# Altium schematic sheet Sheet2.SchDoc
size A4
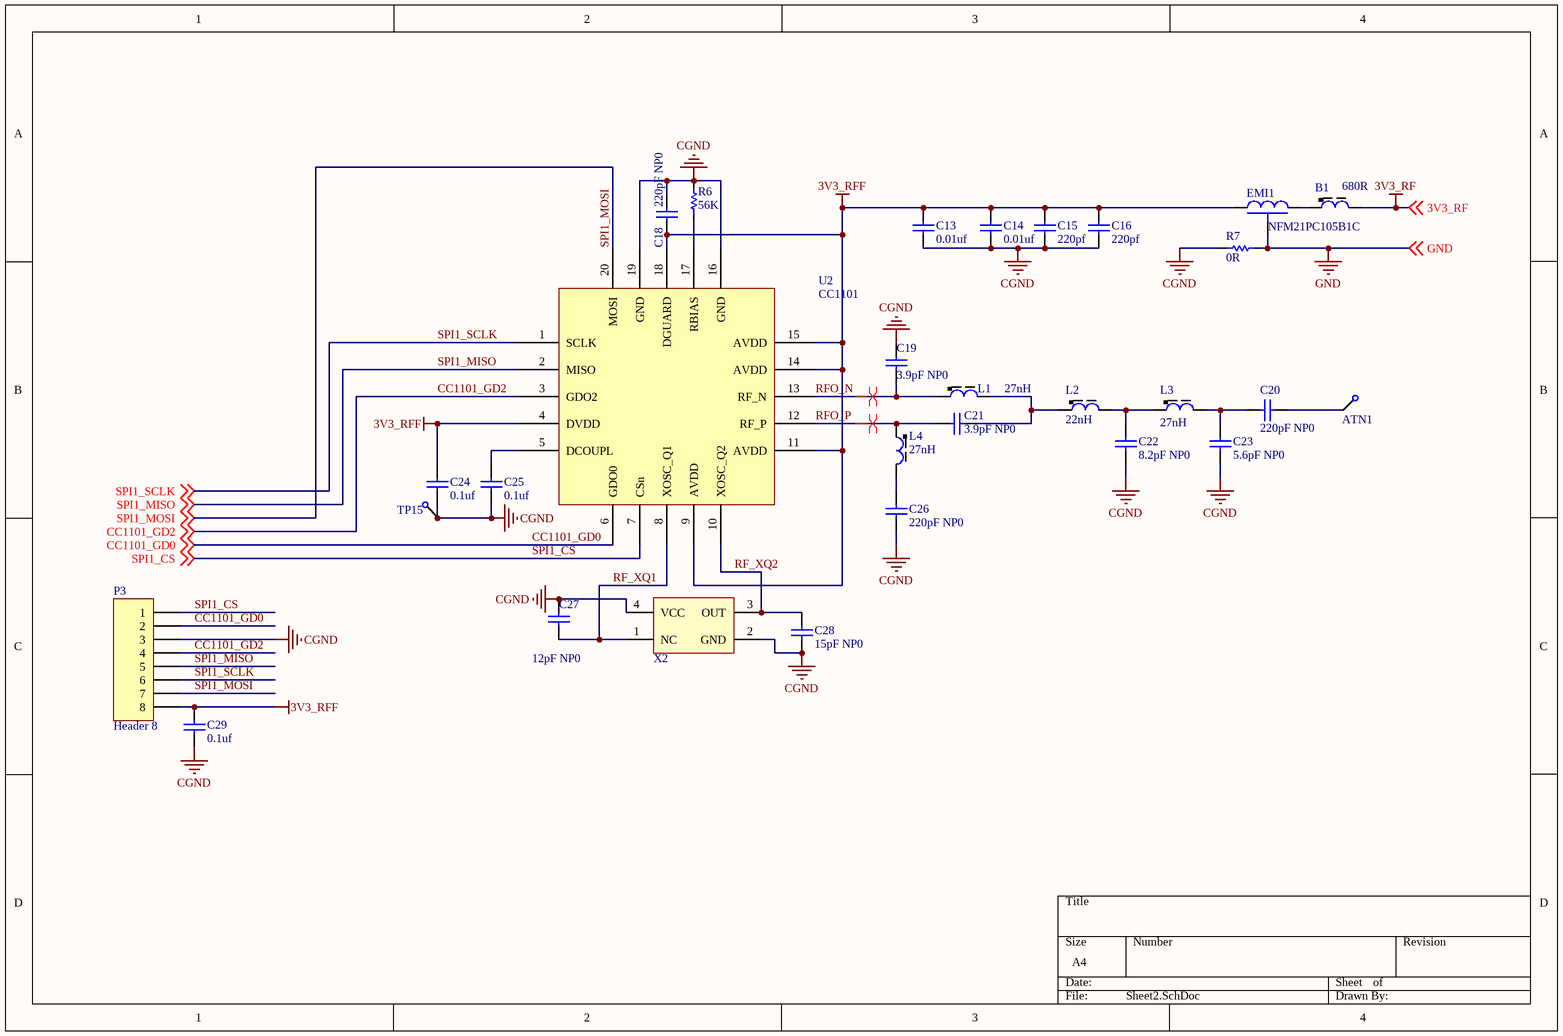
[diagram p0: Sheet2.SchDoc]

## Parts
ATN1  TestPoint  [TP]  (value not drawn)
B1  680R  [L0603]
C13  0.01uf  [C0603]
C14  0.01uf  [C0603]
C15  220pf  [C0603]
C16  220pf  [C0603]
C18  220pF NP0  [C0603]
C19  3.9pF NP0  [C0603]
C20  220pF NP0  [C0603]
C21  3.9pF NP0  [C0603]
C22  8.2pF NP0  [C0603]
C23  5.6pF NP0  [C0603]
C24  0.1uf  [C0603]
C25  0.1uf  [C0603]
C26  220pF NP0  [C0603]
C27  12pF NP0  [C0603]
C28  15pF NP0  [C0603]
C29  0.1uf  [C0603]
EMI1  NFM21PC105B1C  [NFM21PC]
L1  27nH  [L0603]
L2  22nH  [L0603]
L3  27nH  [L0603]
L4  27nH  [L0603]
P3  Header 8  [CC1101]
R6  56K  [R0603]
R7  0R  [R0603]
TP15  TestPoint  [TP_0.8]  (value not drawn)
U2  CC1101  [QFN50P400X400X80_HS-21N]
X2  XTAL4  [XTAL3225]  (value not drawn)

## Nets
3V3_RF: B1.2 ; off-sheet 3V3_RF
3V3_RFF: C13.2 C14.2 C15.2 C16.2 C18.1 C24.2 C29.2 EMI1.1 P3.8 U2.4(DVDD) U2.9(AVDD) U2.11(AVDD) U2.14(AVDD) U2.15(AVDD) U2.18(DGUARD)
CGND: C13.1 C14.1 C15.1 C16.1 C18.2 C19.2 C22.1 C23.1 C24.1 C25.1 C26.1 C27.2 C28.1 C29.1 P3.3 R6.2 R7.1 TP15.1 U2.16(GND) U2.19(GND) X2.2(GND) X2.4(VCC)
GND: EMI1.2 R7.2 ; off-sheet GND
CC1101_GD0: P3.2 U2.6(GDO0) ; off-sheet CC1101_GD0
CC1101_GD2: P3.4 U2.3(GDO2) ; off-sheet CC1101_GD2
RF_XQ1: C27.1 U2.8(XOSC_Q1) X2.1(NC)
RF_XQ2: C28.2 U2.10(XOSC_Q2) X2.3(OUT)
RFO_N: C19.1 L1.1 U2.13(RF_N)
RFO_P: C21.2 L4.1 U2.12(RF_P)
SPI1_CS: P3.1 U2.7(CSn) ; off-sheet SPI1_CS
SPI1_MISO: P3.5 U2.2(MISO) ; off-sheet SPI1_MISO
SPI1_MOSI: P3.7 U2.20(MOSI) ; off-sheet SPI1_MOSI
SPI1_SCLK: P3.6 U2.1(SCLK) ; off-sheet SPI1_SCLK
NetATN1_1: ATN1.1 C20.1
NetB1_1: B1.1 EMI1.3
NetC20_2: C20.2 C23.2 L3.2
NetC21_1: C21.1 L1.2 L2.1
NetC22_2: C22.2 L2.2 L3.1
NetC25_2: C25.2 U2.5(DCOUPL)
NetC26_2: C26.2 L4.2
NetR6_1: R6.1 U2.17(RBIAS)

## Layout directives
differential pair: RFO_N, RFO_P

## Library data of the parts
ATN1 TP15 = TestPoint: 一个测试点
B1 L2 = L
  B1: Value: 680R
  L2: Value: 22nH
C13-C16 C18-C29 = Cap: Capacitor; Option: 25V  X7R
  C13 C14: Value: 0.01uf
  C15 C16: Value: 220pf
  C18 C20 C26: Value: 220pF NP0
  C19 C21: Value: 3.9pF NP0
  C22: Value: 8.2pF NP0
  C23: Value: 5.6pF NP0
  C24 C25 C29: Value: 0.1uf
  C27: Value: 12pF NP0
  C28: Value: 15pF NP0
L1 L3 L4 = L: LQG15HS27NJ02D; Value: 27nH
P3 = Header 8: Header, 8-Pin; LatestRevisionDate: 17-Jul-2002; LatestRevisionNote: Re-released for DXP Platform.; Publisher: Altium Limited
R6 R7 = Res: Published: 8-Jun-2000; LatestRevisionDate: 17-Jul-2002; LatestRevisionNote: Re-released for DXP Platform.; PackageReference: AXIAL-0.3; Publisher: Altium Limited
  R6: Value: 56K
  R7: Value: 0R